# Altium schematic sheet PlumbingMonitoring.SchDoc
size A
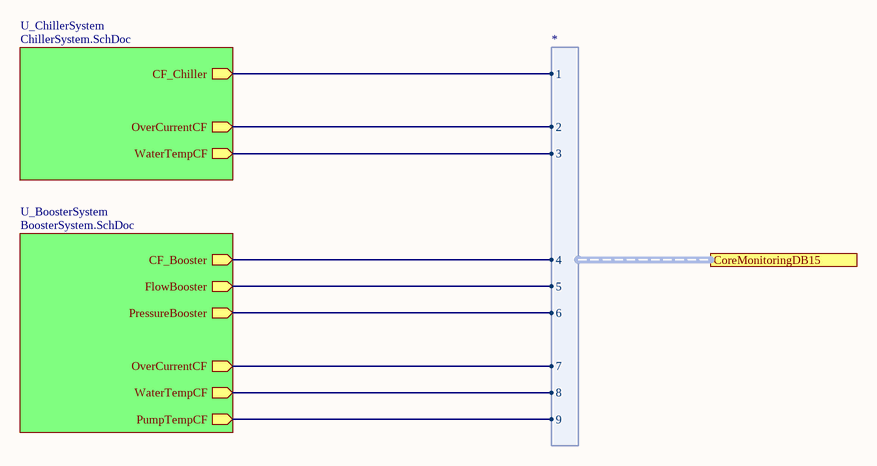
[diagram p0: PlumbingMonitoring.SchDoc]

## Sub-sheets
U_BoosterSystem = BoosterSystem.SchDoc: CF_Booster (out), FlowBooster (out), PressureBooster (out), OverCurrentCF (out), WaterTempCF (out), PumpTempCF (out)
U_ChillerSystem = ChillerSystem.SchDoc: CF_Chiller (out), OverCurrentCF (out), WaterTempCF (out)

## Ports
CoreMonitoringDB15 (harness *)

## Harnesses
*: 1, 2, 3, 4, 5, 6, 7, 8, 9

## Nets
(unnamed): sheet U_ChillerSystem/CF_Chiller, port CoreMonitoringDB15.1
(unnamed): sheet U_ChillerSystem/OverCurrentCF, port CoreMonitoringDB15.2
(unnamed): sheet U_ChillerSystem/WaterTempCF, port CoreMonitoringDB15.3
(unnamed): sheet U_BoosterSystem/CF_Booster, port CoreMonitoringDB15.4
(unnamed): sheet U_BoosterSystem/FlowBooster, port CoreMonitoringDB15.5
(unnamed): sheet U_BoosterSystem/PressureBooster, port CoreMonitoringDB15.6
(unnamed): sheet U_BoosterSystem/OverCurrentCF, port CoreMonitoringDB15.7
(unnamed): sheet U_BoosterSystem/WaterTempCF, port CoreMonitoringDB15.8
(unnamed): sheet U_BoosterSystem/PumpTempCF, port CoreMonitoringDB15.9